# Altium schematic sheet Main Board Motor Control.SchDoc
size A; SheetNumber: 1; SheetTotal: 3
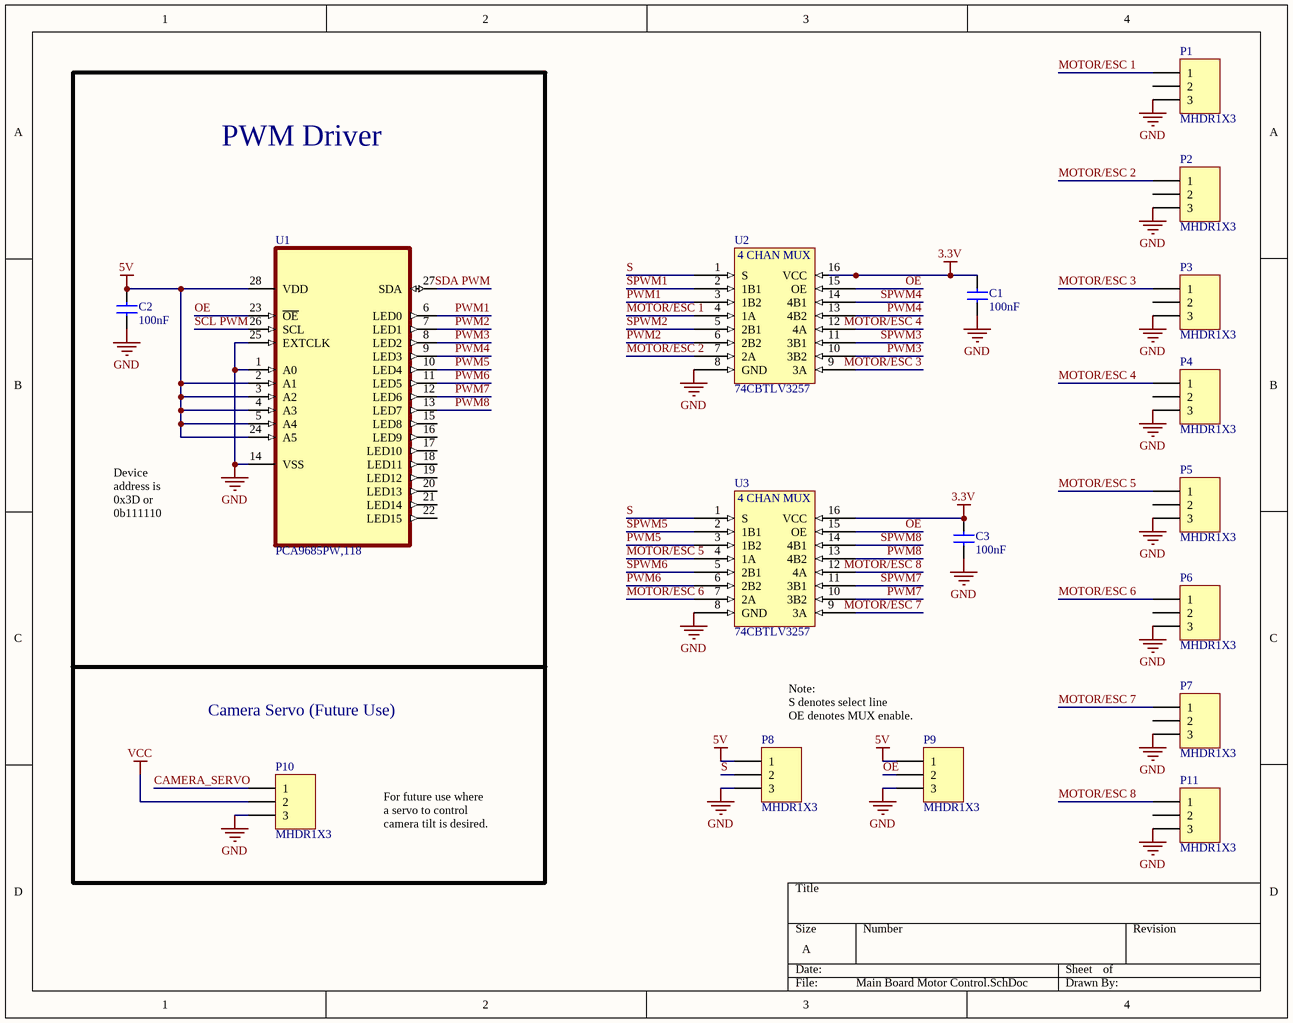
[diagram p0: Main Board Motor Control.SchDoc]

## Parts
C1  value 100nF  [CAPC0603]  (hidden comment: Cap)
C2  value 100nF  [CAPC0603]  (hidden comment: Cap)
C3  value 100nF  [CAPC0603]  (hidden comment: Cap)
P1  MHDR1X3  [MHDR1X3]
P2  MHDR1X3  [MHDR1X3]
P3  MHDR1X3  [MHDR1X3]
P4  MHDR1X3  [MHDR1X3]
P5  MHDR1X3  [MHDR1X3]
P6  MHDR1X3  [MHDR1X3]
P7  MHDR1X3  [MHDR1X3]
P8  MHDR1X3  [MHDR1X3]
P9  MHDR1X3  [MHDR1X3]
P10  MHDR1X3  [MHDR1X3]
P11  MHDR1X3  [MHDR1X3]
U1  PCA9685PW,118  [SOP65P640X110-28N]
U2  74CBTLV3257  [TSSOP16]
U3  74CBTLV3257  [TSSOP16]

## Blocks framed on the sheet
PWM Driver: C2 U1

## Nets
3.3V: C1.1(A) C3.1(A) U2.16(VCC) U3.16(VCC)
5V: C2.1(A) P8.1 P9.1 U1.2(A1) U1.3(A2) U1.4(A3) U1.5(A4) U1.24(A5) U1.28(VDD)
GND: C1.2(B) C2.2(B) C3.2(B) P1.3 P2.3 P3.3 P4.3 P5.3 P6.3 P7.3 P8.3 P9.3 P10.3 P11.3 U1.1(A0) U1.14(VSS) U1.25(EXTCLK) U2.8(GND) U3.8(GND)
VCC: P10.2
CAMERA_SERVO: P10.1
MOTOR/ESC 1: P1.1 U2.4(1A)
MOTOR/ESC 2: P2.1 U2.7(2A)
MOTOR/ESC 3: P3.1 U2.9(3A)
MOTOR/ESC 4: P4.1 U2.12(4A)
MOTOR/ESC 5: P5.1 U3.4(1A)
MOTOR/ESC 6: P6.1 U3.7(2A)
MOTOR/ESC 7: P7.1 U3.9(3A)
MOTOR/ESC 8: P11.1 U3.12(4A)
OE: P9.2 U1.23(~{OE}) U2.15(OE) U3.15(OE)
PWM1: U1.6(LED0) U2.3(1B2)
PWM2: U1.7(LED1) U2.6(2B2)
PWM3: U1.8(LED2) U2.10(3B2)
PWM4: U1.9(LED3) U2.13(4B2)
PWM5: U1.10(LED4) U3.3(1B2)
PWM6: U1.11(LED5) U3.6(2B2)
PWM7: U1.12(LED6) U3.10(3B2)
PWM8: U1.13(LED7) U3.13(4B2)
S: P8.2 U2.1(S) U3.1(S)
SCL PWM: U1.26(SCL)
SDA PWM: U1.27(SDA)
SPWM1: U2.2(1B1)
SPWM2: U2.5(2B1)
SPWM3: U2.11(3B1)
SPWM4: U2.14(4B1)
SPWM5: U3.2(1B1)
SPWM6: U3.5(2B1)
SPWM7: U3.11(3B1)
SPWM8: U3.14(4B1)

Not connected (* = marked no-connect by the designer): P1 2; P2 2; P3 2; P4 2; P5 2; P6 2; P7 2; P11 2; U1 15(LED8) 16(LED9) 17(LED10) 18(LED11) 19(LED12) 20(LED13) 21(LED14) 22(LED15)

## Notes on the sheet
- Device address is 0x3D or 0b111110
- Camera Servo (Future Use)
- Note:
  S denotes select line
  OE denotes MUX enable.
- For future use where a servo to control camera tilt is desired.
- (in symbol 74CBTLV3257) 4 CHAN MUX

## Library data of the parts
P1-P11 = MHDR1X3: Header, 3-Pin; LatestRevisionDate: 17-Jul-2002; LatestRevisionNote: Re-released for DXP Platform.; Publisher: Altium Limited
U1 = PCA9685PW,118: LED Driver IC 16 Output Linear - PWM Dimming 25mA 28-TSSOP; MF: NXP USA; Value: *; MP: PCA9685PW,118; Purchase-URL: https://pricing.snapeda.com/search/part/PCA9685PW,118/?ref=eda; Availability: In Stock; Price: None; Package: TSSOP-28 NXP Semiconductors
U2 U3 = 74CBTLV3257: Mux; 4 channel; 2:1; Demux
C1-C3 = Cap: Supplier 1: Digi-Key; Supplier Part Number 1: 1276-1000-1-ND